# EAGLE design yabc (EAGLE 5.03)
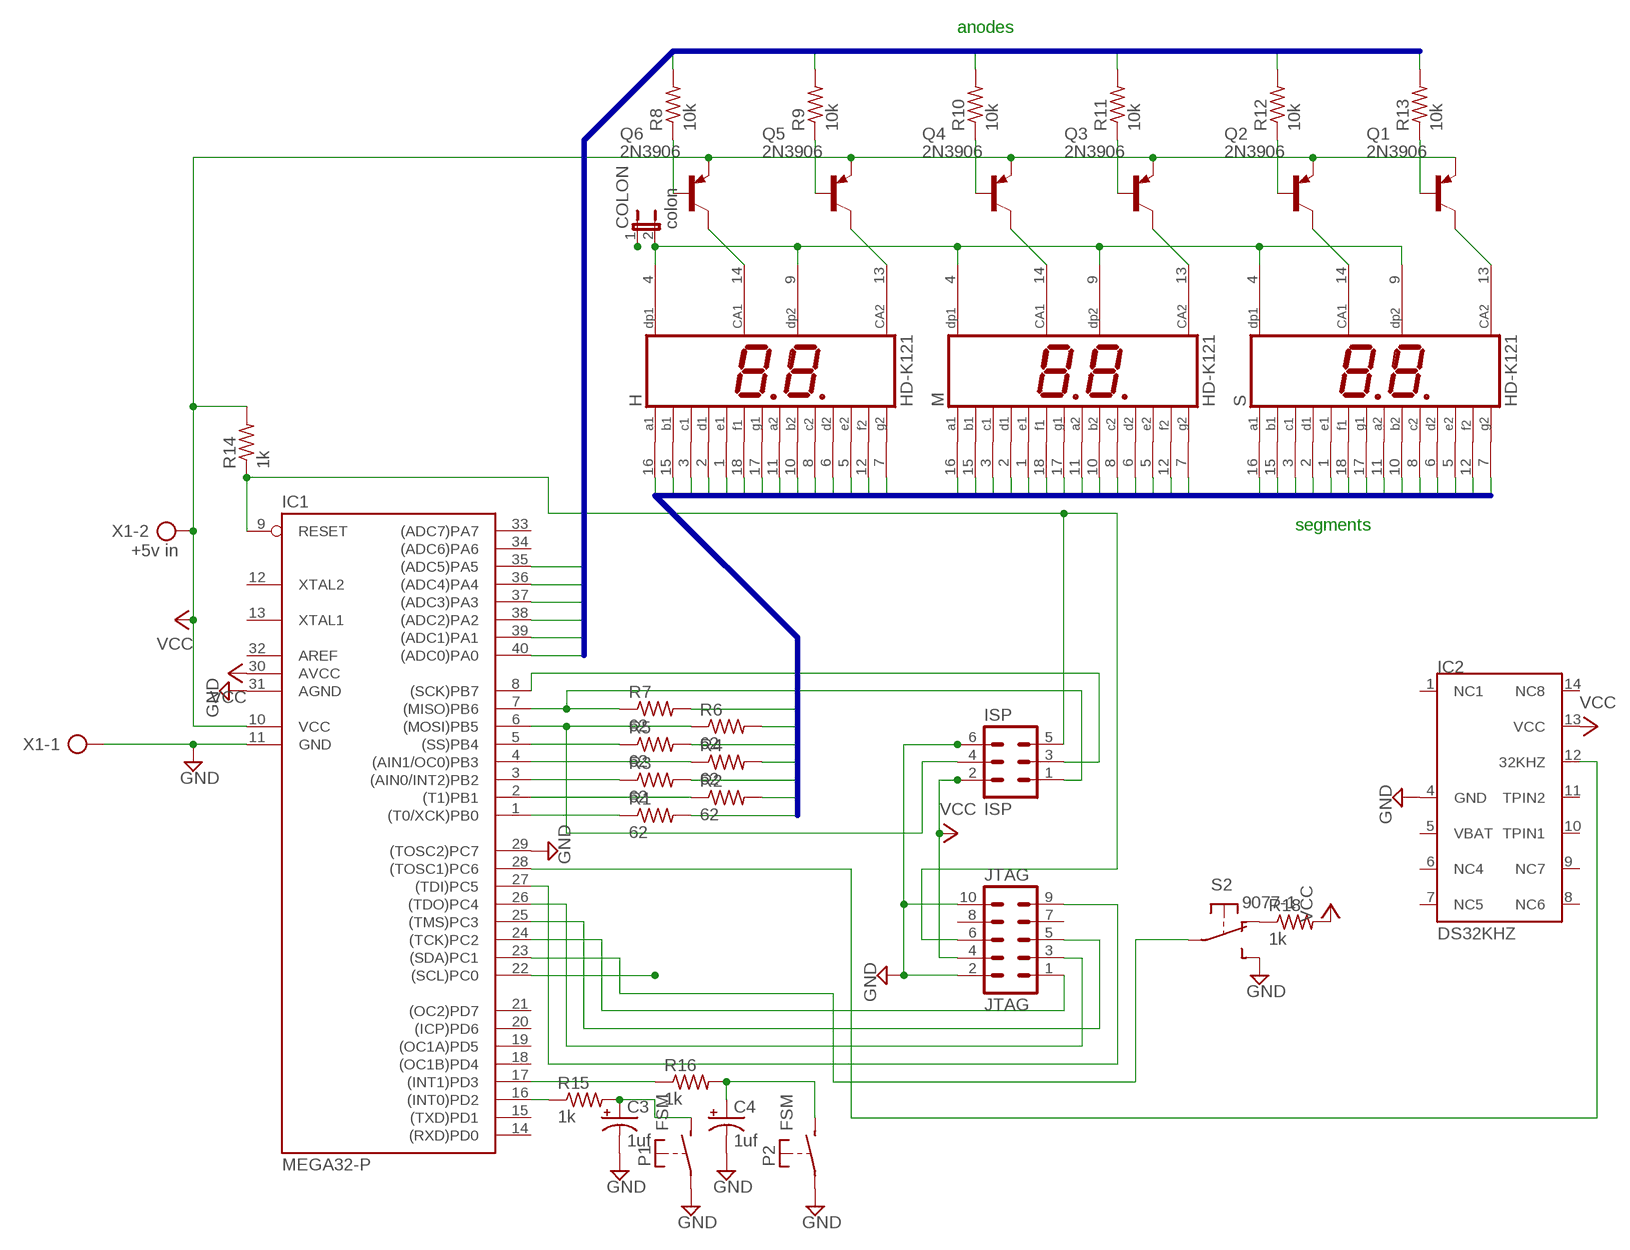
[diagram p0: schematic, sheet 1]

## Parts
C3  1uf  CPOL-USE2.5-5  [E2,5-5]
C4  1uf  CPOL-USE2.5-5  [E2,5-5]
COLON  colon  JP1E  [JP1]
H  HD-K121  [HDSP-R]
IC1  MEGA32-P  [DIL40]
IC2  DS32KHZ  [DS32KHZ]
ISP  ISP  MA03-2  [MA03-2]
JTAG  JTAG  MA05-2  [MA05-2]
M  HD-K121  [HDSP-R]
P1  FSM  [FSM]
P2  FSM  [FSM]
Q1  2N3906  [TO92]
Q2  2N3906  [TO92]
Q3  2N3906  [TO92]
Q4  2N3906  [TO92]
Q5  2N3906  [TO92]
Q6  2N3906  [TO92]
R1  62  R-US_0207/10  [0207/10]
R2  62  R-US_0207/10  [0207/10]
R3  62  R-US_0207/10  [0207/10]
R4  62  R-US_0207/10  [0207/10]
R5  62  R-US_0207/10  [0207/10]
R6  62  R-US_0207/10  [0207/10]
R7  62  R-US_0207/10  [0207/10]
R8  10k  R-US_0207/10  [0207/10]
R9  10k  R-US_0207/10  [0207/10]
R10  10k  R-US_0207/10  [0207/10]
R11  10k  R-US_0207/10  [0207/10]
R12  10k  R-US_0207/10  [0207/10]
R13  10k  R-US_0207/10  [0207/10]
R14  1k  R-US_0207/10  [0207/10]
R15  1k  R-US_0207/10  [0207/10]
R16  1k  R-US_0207/10  [0207/10]
R18  1k  R-US_0207/10  [0207/10]
S  HD-K121  [HDSP-R]
S2  9077-1  [9077-1]
X1  +5v in  AK500/2  [AK500/2]

## Nets
ANODES1: IC1.40((ADC0)PA0) R13.2
ANODES2: IC1.39((ADC1)PA1) R12.2
ANODES3: IC1.38((ADC2)PA2) R11.2
ANODES4: IC1.37((ADC3)PA3) R10.2
ANODES5: IC1.36((ADC4)PA4) R9.2
ANODES6: IC1.35((ADC5)PA5) R8.2
C-ENA: COLON.1 IC1.22((SCL)PC0)
COLON: COLON.2 H.4(DP1) H.9(DP2) M.4(DP1) M.9(DP2) S.4(DP1) S.9(DP2)
GND: C3.- C4.- IC1.11(GND) IC1.29((TOSC2)PC7) IC1.31(AGND) IC2.4(GND) ISP.6 JTAG.2 JTAG.10 P1.P$1(P) P2.P$1(P) S2.1(S) X1.1
N$1: IC1.1((T0/XCK)PB0) R1.1
N$2: IC1.2((T1)PB1) R2.1
N$3: IC1.3((AIN0/INT2)PB2) R3.1
N$4: IC1.4((AIN1/OC0)PB3) R4.1
N$5: IC1.5((SS)PB4) R5.1
N$6: IC1.6((MOSI)PB5) ISP.4 R6.1
N$7: IC1.7((MISO)PB6) ISP.1 R7.1
N$8: Q1.1(C) S.13(CA2)
N$9: Q2.1(C) S.14(CA1)
N$10: M.13(CA2) Q3.1(C)
N$11: M.14(CA1) Q4.1(C)
N$12: H.13(CA2) Q5.1(C)
N$13: H.14(CA1) Q6.1(C)
N$14: Q6.2(B) R8.1
N$15: Q5.2(B) R9.1
N$16: Q4.2(B) R10.1
N$17: Q3.2(B) R11.1
N$18: Q2.2(B) R12.1
N$19: Q1.2(B) R13.1
N$20: IC1.28((TOSC1)PC6) IC2.12(32KHZ)
N$22: IC1.8((SCK)PB7) ISP.3
N$23: IC1.24((TCK)PC2) JTAG.1
N$24: IC1.9(RESET) ISP.5 JTAG.6 R14.1
N$26: IC1.26((TDO)PC4) JTAG.3
N$27: IC1.17((INT1)PD3) R16.1
N$28: IC1.25((TMS)PC3) JTAG.5
N$29: IC1.16((INT0)PD2) R15.1
N$30: IC1.27((TDI)PC5) JTAG.9
N$31: C3.+ P1.P$2(S) R15.2
N$32: C4.+ P2.P$2(S) R16.2
N$34: IC1.23((SDA)PC1) S2.2(P)
N$36: R18.1 S2.3(O)
SEG1: H.11(A2) H.16(A1) M.11(A2) M.16(A1) R1.2 S.11(A2) S.16(A1)
SEG2: H.10(B2) H.15(B1) M.10(B2) M.15(B1) R2.2 S.10(B2) S.15(B1)
SEG3: H.3(C1) H.8(C2) M.3(C1) M.8(C2) R3.2 S.3(C1) S.8(C2)
SEG4: H.2(D1) H.6(D2) M.2(D1) M.6(D2) R4.2 S.2(D1) S.6(D2)
SEG5: H.1(E1) H.5(E2) M.1(E1) M.5(E2) R5.2 S.1(E1) S.5(E2)
SEG6: H.12(F2) H.18(F1) M.12(F2) M.18(F1) R6.2 S.12(F2) S.18(F1)
SEG7: H.7(G2) H.17(G1) M.7(G2) M.17(G1) R7.2 S.7(G2) S.17(G1)
VCC: IC1.10(VCC) IC1.30(AVCC) IC2.13(VCC) ISP.2 JTAG.4 Q1.3(E) Q2.3(E) Q3.3(E) Q4.3(E) Q5.3(E) Q6.3(E) R14.2 R18.2 X1.2
Unconnected: IC1.12(XTAL2) IC1.13(XTAL1) IC1.14((RXD)PD0) IC1.15((TXD)PD1) IC1.18((OC1B)PD4) IC1.19((OC1A)PD5) IC1.20((ICP)PD6) IC1.21((OC2)PD7) IC1.32(AREF) IC1.33((ADC7)PA7) IC1.34((ADC6)PA6) IC2.1(NC1) IC2.6(NC4) IC2.7(NC5) IC2.8(NC6) IC2.9(NC7) IC2.10(TPIN1) IC2.11(TPIN2) IC2.14(NC8) JTAG.7 JTAG.8

## Buses
SEG[1..7]
ANODES[1..6]

## Notes on the sheet
- anodes
- segments

## Power pins joined to a net without a drawn wire
VBAT: IC2.5(VBAT)

## Library data of the parts
C3 C4 = resistor:CPOL-US: POLARIZED CAPACITOR, American symbol
COLON = jumper:JP1E: JUMPER
H M S = display-hp:HD-K121: LED DISPLAY 2 x 1 character 7 segment, decimal points right
IC1 = atmel:MEGA32-P: MICROCONTROLLER 32 Kbytes FLASH 2 Kbytes SRAM 1 Kbytes EEPROM USART 8-channel 10 bit ADC Source: www.atmel.com .. doc2503.pdf
IC2 = dallas-1:DS32KHZ: 32.768KHz Precision Oscillator w/battery backup
ISP = con-lstb:MA03-2: PIN HEADER
JTAG = con-lstb:MA05-2: PIN HEADER
P1 P2 = switch-misc-2:FSM: TYCO SWITCH
Q1-Q6 = transistor-pnp:2N3906: PNP Transistor
R1-R16 R18 = resistor:R-US_: RESISTOR, American symbol
S2 = switch-misc-2:9077-1: MARQUARDT SWITCH
X1 = con-ptr500:AK500/2: CONNECTOR

## Board
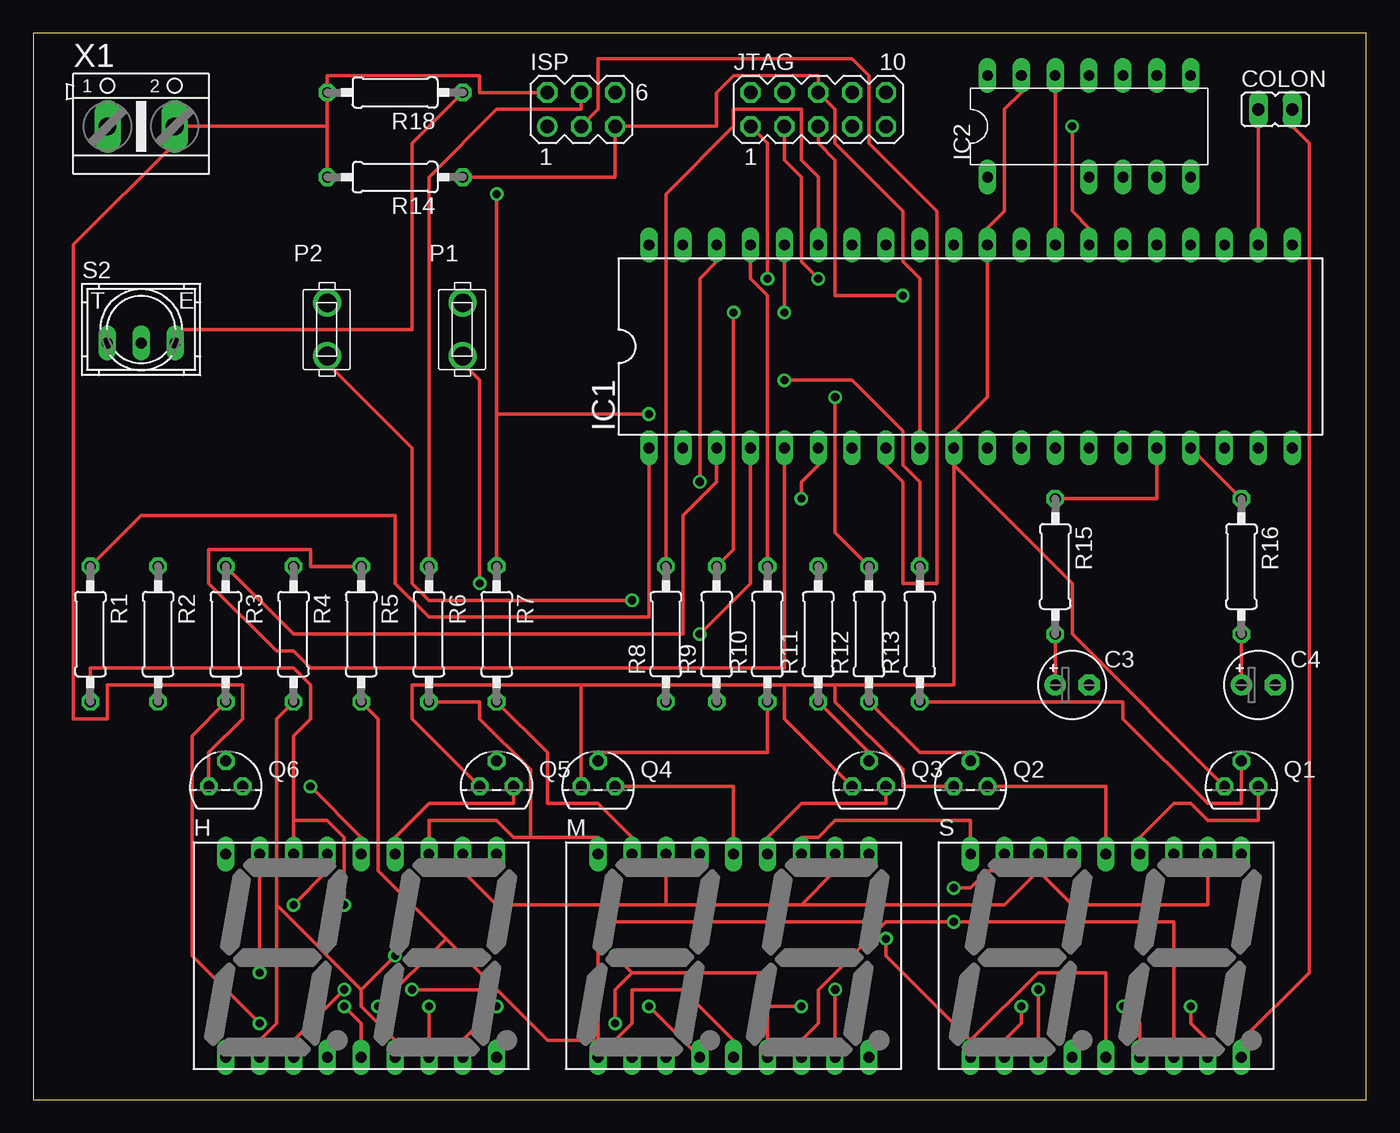
[diagram p1: board, top side]
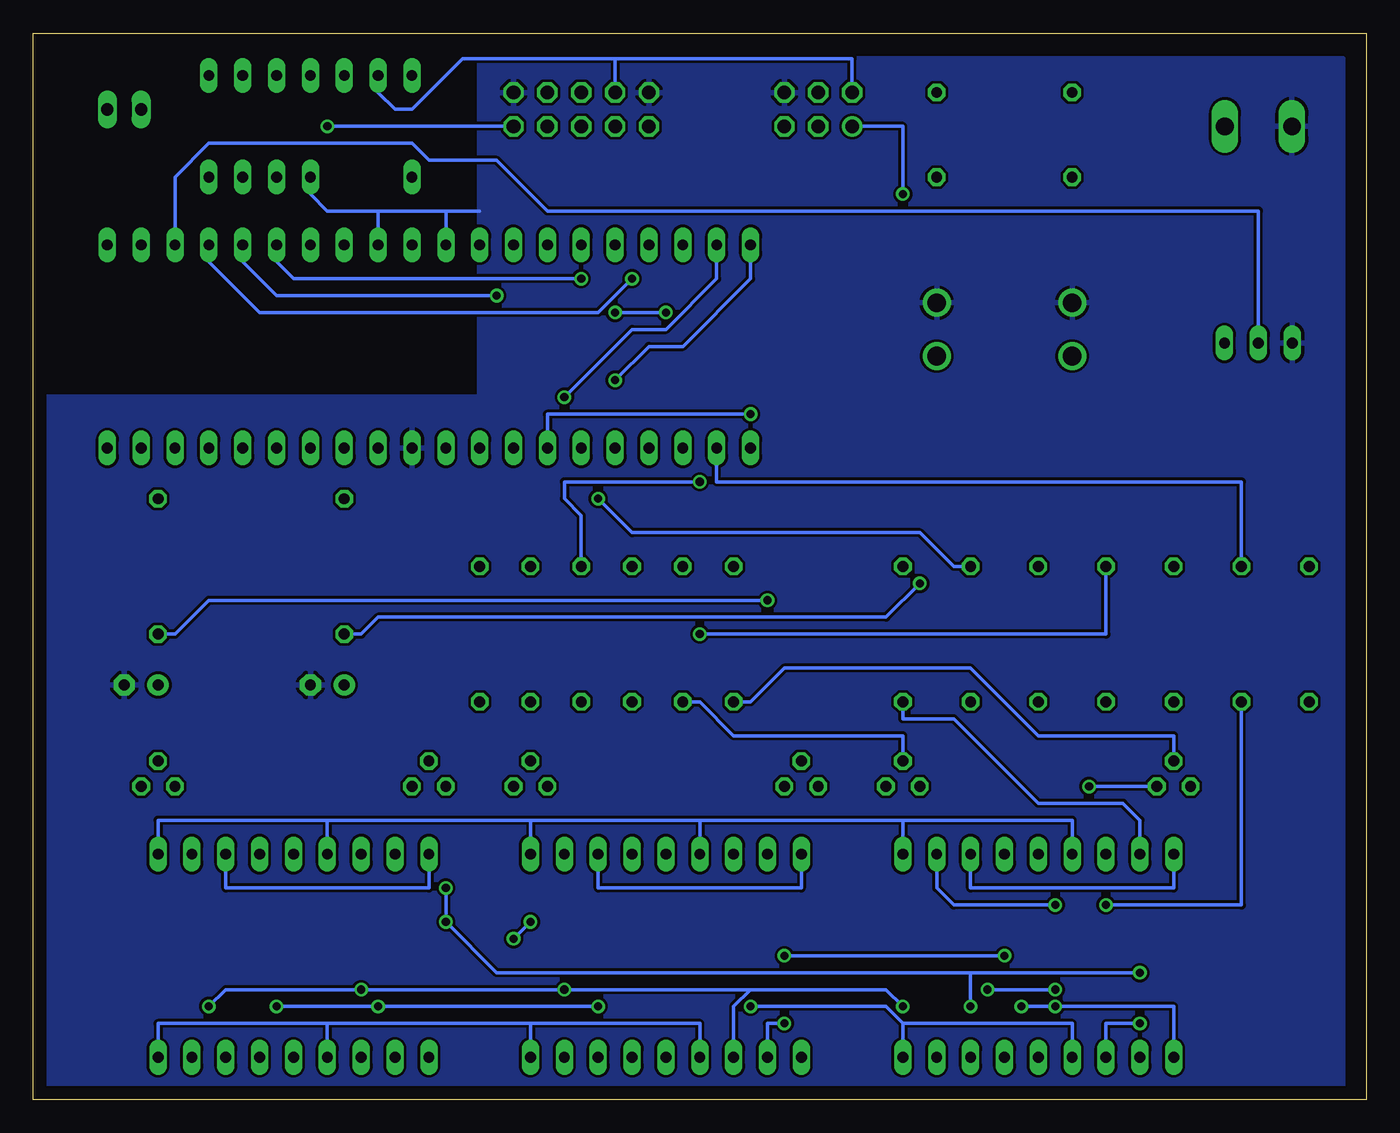
[diagram p2: board, bottom side, seen from below]

Size 100 x 80 mm. Coordinates in mm from the lower left corner, seen from the top.
Outline: 0,0 100,0 100,80 0,80 0,0
Copper layers (1*16): Top 0.035mm / dielectric 1.5mm / Bottom 0.035mm
Design rules "default": minimum track width 10mil, minimum drill 24mil, track to track 8mil, track to pad 8mil, pad to pad 8mil, via to via 8mil, smd to smd 8mil, copper to edge 40mil, drill to drill 8mil, minimum pad ring 10mil, minimum via ring 8mil, stop-mask expansion 4mil, vias tented up to drill 0mil, thermal gap 10mil

### Footprints (pad centres in the part's own frame; a part is rotated, then mirrored left to right if it is on the bottom)
E2,5-5 = drill 0.813 pad 1.6 round: + -1.27,0 | drill 0.813 pad 1.6 octagon: - 1.27,0
JP1 = drill 0.914 long: 1 0,-1.27; 2 0,1.27
HDSP-R = drill 0.813 long: 1 -10.16,-7.62; 2 -7.62,-7.62; 3 -5.08,-7.62; 4 -2.54,-7.62; 5 0,-7.62; 6 2.54,-7.62; 7 5.08,-7.62; 8 7.62,-7.62; 9 10.16,-7.62; 10 10.16,7.62; 11 7.62,7.62; 12 5.08,7.62; 13 2.54,7.62; 14 0,7.62; 15 -2.54,7.62; 16 -5.08,7.62; 17 -7.62,7.62; 18 -10.16,7.62
DIL40 = drill 0.813 long: 1 -24.13,-7.62; 2 -21.59,-7.62; 3 -19.05,-7.62; 4 -16.51,-7.62; 5 -13.97,-7.62; 6 -11.43,-7.62; 7 -8.89,-7.62; 8 -6.35,-7.62; 9 -3.81,-7.62; 10 -1.27,-7.62; 11 1.27,-7.62; 12 3.81,-7.62; 13 6.35,-7.62; 14 8.89,-7.62; 15 11.43,-7.62; 16 13.97,-7.62; 17 16.51,-7.62; 18 19.05,-7.62; 19 21.59,-7.62; 20 24.13,-7.62; 21 24.13,7.62; 22 21.59,7.62; 23 19.05,7.62; 24 16.51,7.62; 25 13.97,7.62; 26 11.43,7.62; 27 8.89,7.62; 28 6.35,7.62; 29 3.81,7.62; 30 1.27,7.62; 31 -1.27,7.62; 32 -3.81,7.62; 33 -6.35,7.62; 34 -8.89,7.62; 35 -11.43,7.62; 36 -13.97,7.62; 37 -16.51,7.62; 38 -19.05,7.62; 39 -21.59,7.62; 40 -24.13,7.62
DS32KHZ = drill 0.8 long: 1 -7.62,-3.81; 4 0,-3.81; 5 2.54,-3.81; 6 5.08,-3.81; 7 7.62,-3.81; 8 7.62,3.81; 9 5.08,3.81; 10 2.54,3.81; 11 0,3.81; 12 -2.54,3.81; 13 -5.08,3.81; 14 -7.62,3.81
MA03-2 = drill 1.016 round: 1 -2.54,-1.27 | drill 1.016 octagon: 2 -2.54,1.27; 3 0,-1.27; 4 0,1.27; 5 2.54,-1.27; 6 2.54,1.27
MA05-2 = drill 1.016 octagon: 1 -5.08,-1.27; 2 -5.08,1.27; 3 -2.54,-1.27; 4 -2.54,1.27; 5 0,-1.27; 6 0,1.27; 7 2.54,-1.27; 8 2.54,1.27; 9 5.08,-1.27; 10 5.08,1.27
FSM = drill 1.397 round: P$1 0,2; P$2 0,-2
TO92 = drill 0.813 octagon: 1 1.27,0; 2 0,1.905; 3 -1.27,0
0207/10 = drill 0.813 octagon: 1 -5.08,0; 2 5.08,0
9077-1 = drill 0.813 long: 1 -2.54,-1.016; 2 0,-1.016; 3 2.54,-1.016
AK500/2 = drill 1.321 long: 1 -2.515,0; 2 2.515,0

### Placement (x,y rotation side)
C3  77.94,31.11 0 top
C4  91.91,31.11 0 top
COLON  93.18,74.29 270 top
H  24.6,10.79 0 top
IC1  70.32,56.51 0 top
IC2  79.21,73.02 0 top
ISP  41.11,74.29 0 top
JTAG  58.89,74.29 0 top
M  52.54,10.79 0 top
P1  32.22,57.78 0 top
P2  22.06,57.78 0 top
Q1  90.64,23.49 0 top
Q2  70.32,23.49 0 top
Q3  62.7,23.49 0 top
Q4  42.38,23.49 0 top
Q5  34.76,23.49 0 top
Q6  14.44,23.49 0 top
R1  4.28,34.92 270 top
R2  9.36,34.92 270 top
R3  14.44,34.92 270 top
R4  19.52,34.92 270 top
R5  24.6,34.92 270 top
R6  29.68,34.92 270 top
R7  34.76,34.92 270 top
R8  47.46,34.92 90 top
R9  51.27,34.92 90 top
R10  55.08,34.92 90 top
R11  58.89,34.92 90 top
R12  62.7,34.92 90 top
R13  66.51,34.92 90 top
R14  27.14,69.21 180 top
R15  76.67,40 270 top
R16  90.64,40 270 top
R18  27.14,75.56 180 top
S  80.48,10.79 0 top
S2  8.09,57.78 0 top
X1  8.09,73.02 0 top

### Tracks (layer width: path | path; a pad name or v marks a point on that pad's centre or on a via)
ANODES1  (via drill 0.61)
  Top 0.254: R13.2 66.51,46.35 65.24,47.62 65.24,50.16 61.43,53.97 v56.35,53.97
  Bottom 0.254: v56.35,53.97 53.81,56.51 51.27,56.51 46.19,61.59 IC1.40
ANODES2  (via drill 0.61)
  Top 0.254: R12.2 60.16,42.54 v60.16,52.7
  Bottom 0.254: v60.16,52.7 55.08,57.78 52.54,57.78 48.73,61.59 IC1.39
ANODES3  (via drill 0.61)
  Top 0.254: v50,46.35 50,61.59 51.27,62.86 IC1.38
  Bottom 0.254: R11.2 58.89,43.81 60.16,45.08 60.16,46.35 v50,46.35
ANODES4
  Top 0.254: R10.2 55.08,60.32 53.81,61.59 IC1.37
ANODES5  (via drill 0.61)
  Top 0.254: R9.2 52.54,41.27 v52.54,59.05 | v56.35,59.05 IC1.36
  Bottom 0.254: v52.54,59.05 v56.35,59.05
ANODES6
  Top 0.254: R8.2 47.46,67.94 52.54,73.02 52.54,74.29 57.62,74.29 57.62,70.48 58.89,69.21 IC1.35
C-ENA
  Top 0.254: IC1.22 COLON.1
COLON  (via drill 0.61)
  Top 0.254: COLON.2 94.45,73.02 95.72,71.75 95.72,9.52 90.64,4.44 S.9 | v46.19,6.98 M.4
  Bottom 0.254: 34.76,5.71 22.06,5.71 H.4 | 34.76,5.71 H.9 | 62.7,5.71 50,5.71 M.4 | 62.7,5.71 M.9 | 62.7,5.71 77.94,5.71 | 77.94,5.71 S.4 | 77.94,5.71 90.64,5.71 S.9 | 34.76,5.71 36.03,6.98 v46.19,6.98
GND
  Bottom 0.254: 69.05,66.67 66.51,66.67 | 69.05,66.67 74.13,66.67 | 74.13,66.67 77.94,66.67 79.21,67.94 IC2.4 | IC1.31 69.05,66.67 | 74.13,66.67 IC1.29
  pour Bottom: 99.53,0.63 99.53,52.7 66.51,52.7 66.51,78.1 1.74,78.1 1.74,0.63
N$1
  Top 0.254: R1.1 8.09,43.81 27.14,43.81 27.14,38.73 29.68,36.19 46.19,36.19 IC1.1
N$2
  Bottom 0.254: R2.1 9.36,46.35 48.73,46.35 IC1.2
N$3
  Top 0.254: R3.1 19.52,34.92 48.73,34.92 48.73,43.81 51.27,46.35 IC1.3
N$4  (via drill 0.61)
  Top 0.254: v50,34.92 53.81,38.73 IC1.4
  Bottom 0.254: R4.1 19.52,34.92 v50,34.92
N$5
  Top 0.254: R5.1 20.79,40 20.79,41.27 13.17,41.27 13.17,38.73 18.25,33.65 19.52,33.65 20.79,32.38 56.35,32.38 IC1.5
N$6  (via drill 0.61)
  Top 0.254: R6.1 29.68,69.21 34.76,74.29 41.11,74.29 ISP.4 | v57.62,45.08 57.62,46.35 58.89,47.62 IC1.6
  Bottom 0.254: v57.62,45.08 55.08,42.54 33.49,42.54 30.95,40 R6.1
N$7  (via drill 0.61)
  Top 0.254: 34.76,51.43 v34.76,67.94 | R7.1 34.76,51.43 | 34.76,51.43 v46.19,51.43
  Bottom 0.254: v34.76,67.94 34.76,73.02 ISP.1 | v46.19,51.43 61.43,51.43 IC1.7
N$8
  Top 0.254: Q1.1 91.91,20.95 88.1,20.95 86.83,22.22 85.56,22.22 83.02,19.68 S.13
N$9
  Top 0.254: Q2.1 80.48,23.49 S.14
N$10
  Top 0.254: Q3.1 63.97,22.22 57.62,22.22 55.08,19.68 M.13
N$11
  Top 0.254: Q4.1 52.54,23.49 M.14
N$12
  Top 0.254: Q5.1 36.03,22.22 29.68,22.22 27.14,19.68 H.13
N$13  (via drill 0.61)
  Top 0.254: v20.79,23.49 24.6,19.68 H.14
  Bottom 0.254: Q6.1 v20.79,23.49
N$14
  Bottom 0.254: R8.1 46.19,29.84 43.65,32.38 29.68,32.38 24.6,27.3 14.44,27.3 Q6.2
N$15
  Bottom 0.254: R9.1 50,29.84 47.46,27.3 34.76,27.3 Q5.2
N$16
  Top 0.254: R10.1 55.08,26.03 42.38,26.03 Q4.2
N$17
  Top 0.254: R11.1 62.7,26.03 Q3.2
N$18
  Top 0.254: R12.1 66.51,26.03 70.32,26.03 Q2.2
N$19
  Top 0.254: R13.1 81.75,29.84 81.75,28.57 88.1,22.22 90.64,22.22 Q1.2
N$20
  Top 0.254: IC1.28 IC2.12
N$22
  Top 0.254: ISP.3 42.38,74.29 42.38,78.1 61.43,78.1 62.7,76.83 62.7,71.75 67.78,66.67 67.78,38.73 65.24,38.73 65.24,46.35 63.97,47.62 IC1.8
N$23  (via drill 0.61)
  Top 0.254: v55.08,61.59 55.08,71.75 JTAG.1
  Bottom 0.254: v55.08,61.59 57.62,59.05 83.02,59.05 86.83,62.86 IC1.24
N$24
  Top 0.254: R14.1 43.65,69.21 ISP.5 51.27,73.02 51.27,75.56 52.54,76.83 58.89,76.83 JTAG.6 60.16,74.29 60.16,71.75 65.24,66.67 65.24,62.86 66.51,61.59 IC1.9
N$26  (via drill 0.61)
  Top 0.254: v58.89,61.59 57.62,62.86 57.62,69.21 56.35,70.48 JTAG.3
  Bottom 0.254: v58.89,61.59 80.48,61.59 81.75,62.86 IC1.26
N$27
  Top 0.254: R16.1 IC1.17
N$28  (via drill 0.61)
  Top 0.254: v65.24,60.32 60.16,60.32 60.16,70.48 58.89,71.75 JTAG.5
  Bottom 0.254: v65.24,60.32 81.75,60.32 84.29,62.86 IC1.25
N$29
  Top 0.254: R15.1 84.29,45.08 IC1.16
N$30  (via drill 0.61)
  Top 0.254: v77.94,73.02 77.94,66.67 79.21,65.4 IC1.27
  Bottom 0.254: JTAG.9 v77.94,73.02
N$31  (via drill 0.61)
  Top 0.254: R15.2 C3.+ | v33.49,38.73 33.49,53.97 32.22,55.24 P1.P$2
  Bottom 0.254: v33.49,38.73 36.03,36.19 74.13,36.19 75.4,34.92 R15.2
N$32  (via drill 0.61)
  Top 0.254: R16.2 C4.+ | v44.92,37.46 29.68,37.46 28.41,38.73 28.41,48.89 22.06,55.24 P2.P$2
  Bottom 0.254: v44.92,37.46 86.83,37.46 89.37,34.92 R16.2
N$34
  Bottom 0.254: S2.2 8.09,66.67 61.43,66.67 65.24,70.48 70.32,70.48 71.59,71.75 86.83,71.75 89.37,69.21 IC1.23
N$36
  Top 0.254: R18.1 28.41,71.75 28.41,57.78 10.63,57.78 S2.3
SEG1  (via drill 0.61)
  Top 0.254: 19.52,20.95 19.52,27.3 20.79,28.57 20.79,31.11 19.52,32.38 4.28,32.38 R1.2 | 19.52,20.95 H.16 | 75.4,17.14 77.94,14.6 88.1,14.6 S.11 | 47.46,14.6 34.76,14.6 32.22,17.14 H.11 | 47.46,14.6 M.16 | 57.62,14.6 60.16,17.14 M.11 | 47.46,14.6 57.62,14.6 | 75.4,17.14 72.86,14.6 57.62,14.6 | 75.4,17.14 S.16 | 19.52,20.95 22.06,20.95 23.33,19.68 v23.33,14.6
  Bottom 0.254: v23.33,14.6 30.95,14.6 32.22,15.87 H.11
SEG2  (via drill 0.61)
  Top 0.254: v19.52,14.6 22.06,17.14 H.15
  Bottom 0.254: 34.76,20.95 22.06,20.95 H.15 | 34.76,20.95 H.10 | 34.76,20.95 50,20.95 | 50,20.95 M.15 | 50,20.95 62.7,20.95 | 62.7,20.95 M.10 | 62.7,20.95 77.94,20.95 | 77.94,20.95 S.15 | 77.94,20.95 90.64,20.95 S.10 | R2.2 9.36,14.6 v19.52,14.6
SEG3  (via drill 0.61)
  Top 0.254: v16.98,5.71 11.9,10.79 11.9,27.3 R3.2 | 33.49,5.71 v34.76,6.98 | 33.49,5.71 32.22,4.44 H.8 | v60.16,8.25 M.8 | v75.4,8.25 S.3 | v86.83,6.98 86.83,5.71 88.1,4.44 S.8 | v23.33,8.25 19.52,4.44 H.3 | v28.41,8.25 33.49,8.25 33.49,5.71
  Bottom 0.254: v16.98,5.71 19.52,5.71 H.3 | v34.76,6.98 36.03,8.25 46.19,8.25 | 46.19,8.25 47.46,6.98 M.3 | 46.19,8.25 v60.16,8.25 v75.4,8.25 85.56,8.25 v86.83,6.98 | v23.33,8.25 v28.41,8.25
SEG4  (via drill 0.61)
  Top 0.254: 18.25,14.6 18.25,28.57 R4.2 | 18.25,14.6 18.25,5.71 16.98,4.44 H.2 | 24.6,8.25 24.6,6.98 27.14,4.44 H.6 | 18.25,14.6 24.6,8.25 | v74.13,6.98 74.13,5.71 72.86,4.44 S.2 | v81.75,6.98 83.02,5.71 S.6 | v43.65,5.71 43.65,8.25 44.92,9.52 | 44.92,9.52 55.08,9.52 55.08,6.98 | 55.08,6.98 M.6 | 55.08,6.98 v57.62,6.98 | 24.6,8.25 v27.14,10.79 | v43.65,10.79 44.92,9.52
  Bottom 0.254: v81.75,6.98 v74.13,6.98 v57.62,6.98 | v43.65,5.71 44.92,5.71 M.2 | v27.14,10.79 v43.65,10.79
SEG5  (via drill 0.61)
  Top 0.254: 70.32,4.44 75.4,9.52 80.48,9.52 S.5 | v23.33,6.98 24.6,5.71 H.5 | R5.2 25.87,28.57 25.87,17.14 30.95,12.06 | 30.95,12.06 38.57,4.44 42.38,4.44 | M.5 52.54,4.44 48.73,8.25 44.92,8.25 44.92,5.71 M.1 42.38,4.44 | v25.87,6.98 30.95,12.06 | 70.32,4.44 63.97,10.79 v63.97,12.06 | v62.7,13.33 42.38,13.33 42.38,4.44 | 70.32,4.44 S.1
  Bottom 0.254: H.1 14.44,6.98 v23.33,6.98 v25.87,6.98 | v62.7,13.33 v63.97,12.06
SEG6
  Top 0.254: M.12 57.62,19.68 58.89,19.68 60.16,20.95 70.32,20.95 S.18 | 37.3,19.68 36.03,19.68 34.76,20.95 29.68,20.95 H.12 | 37.3,19.68 42.38,19.68 M.18 | R6.2 33.49,29.84 33.49,28.57 37.3,24.76 37.3,19.68
  Bottom 0.254: S.12 85.56,15.87 70.32,15.87 S.18 | H.18 14.44,15.87 29.68,15.87 H.12 | M.12 57.62,15.87 42.38,15.87 M.18
SEG7  (via drill 0.61)
  Top 0.254: M.7 57.62,4.44 58.89,5.71 58.89,8.25 63.97,13.33 v69.05,13.33 85.56,13.33 S.7 | v69.05,15.87 70.32,15.87 71.59,17.14 72.86,17.14 S.17 | R7.2 38.57,26.03 38.57,22.22 42.38,22.22 44.92,19.68 M.17 | v29.68,6.98 H.7 | v16.98,9.52 H.17
  Bottom 0.254: v69.05,15.87 v69.05,13.33 65.24,9.52 29.68,9.52 | 29.68,9.52 v29.68,6.98 | v16.98,9.52 29.68,9.52 | R7.2 34.76,28.57 30.95,28.57 24.6,22.22 18.25,22.22 16.98,20.95 H.17
VCC
  Top 0.254: 22.06,73.02 R18.2 22.06,76.83 33.49,76.83 33.49,75.56 ISP.2 | 22.06,73.02 R14.2 | Q6.3 13.17,26.03 15.71,28.57 15.71,31.11 5.55,31.11 5.55,28.57 3.01,28.57 3.01,64.13 10.63,71.75 X1.2 22.06,73.02 | Q5.3 28.41,28.57 28.41,31.11 41.11,31.11 | 41.11,31.11 Q4.3 | Q3.3 56.35,28.57 56.35,31.11 | 56.35,31.11 41.11,31.11 | Q2.3 65.24,23.49 65.24,24.76 60.16,29.84 60.16,31.11 | 60.16,31.11 56.35,31.11 | IC2.13 74.13,75.56 72.86,74.29 72.86,66.67 71.59,65.4 IC1.30 71.59,52.7 69.05,50.16 IC1.10 69.05,47.62 | Q1.3 77.94,34.92 77.94,38.73 69.05,47.62 | 60.16,31.11 69.05,31.11 69.05,47.62
  Bottom 0.254: 56.35,78.1 JTAG.4 | 56.35,78.1 67.78,78.1 71.59,74.29 72.86,74.29 74.13,75.56 IC2.13 | ISP.2 38.57,78.1 56.35,78.1